# Altium schematic sheet DDR4_SODIMM_PWR.SchDoc
size A3
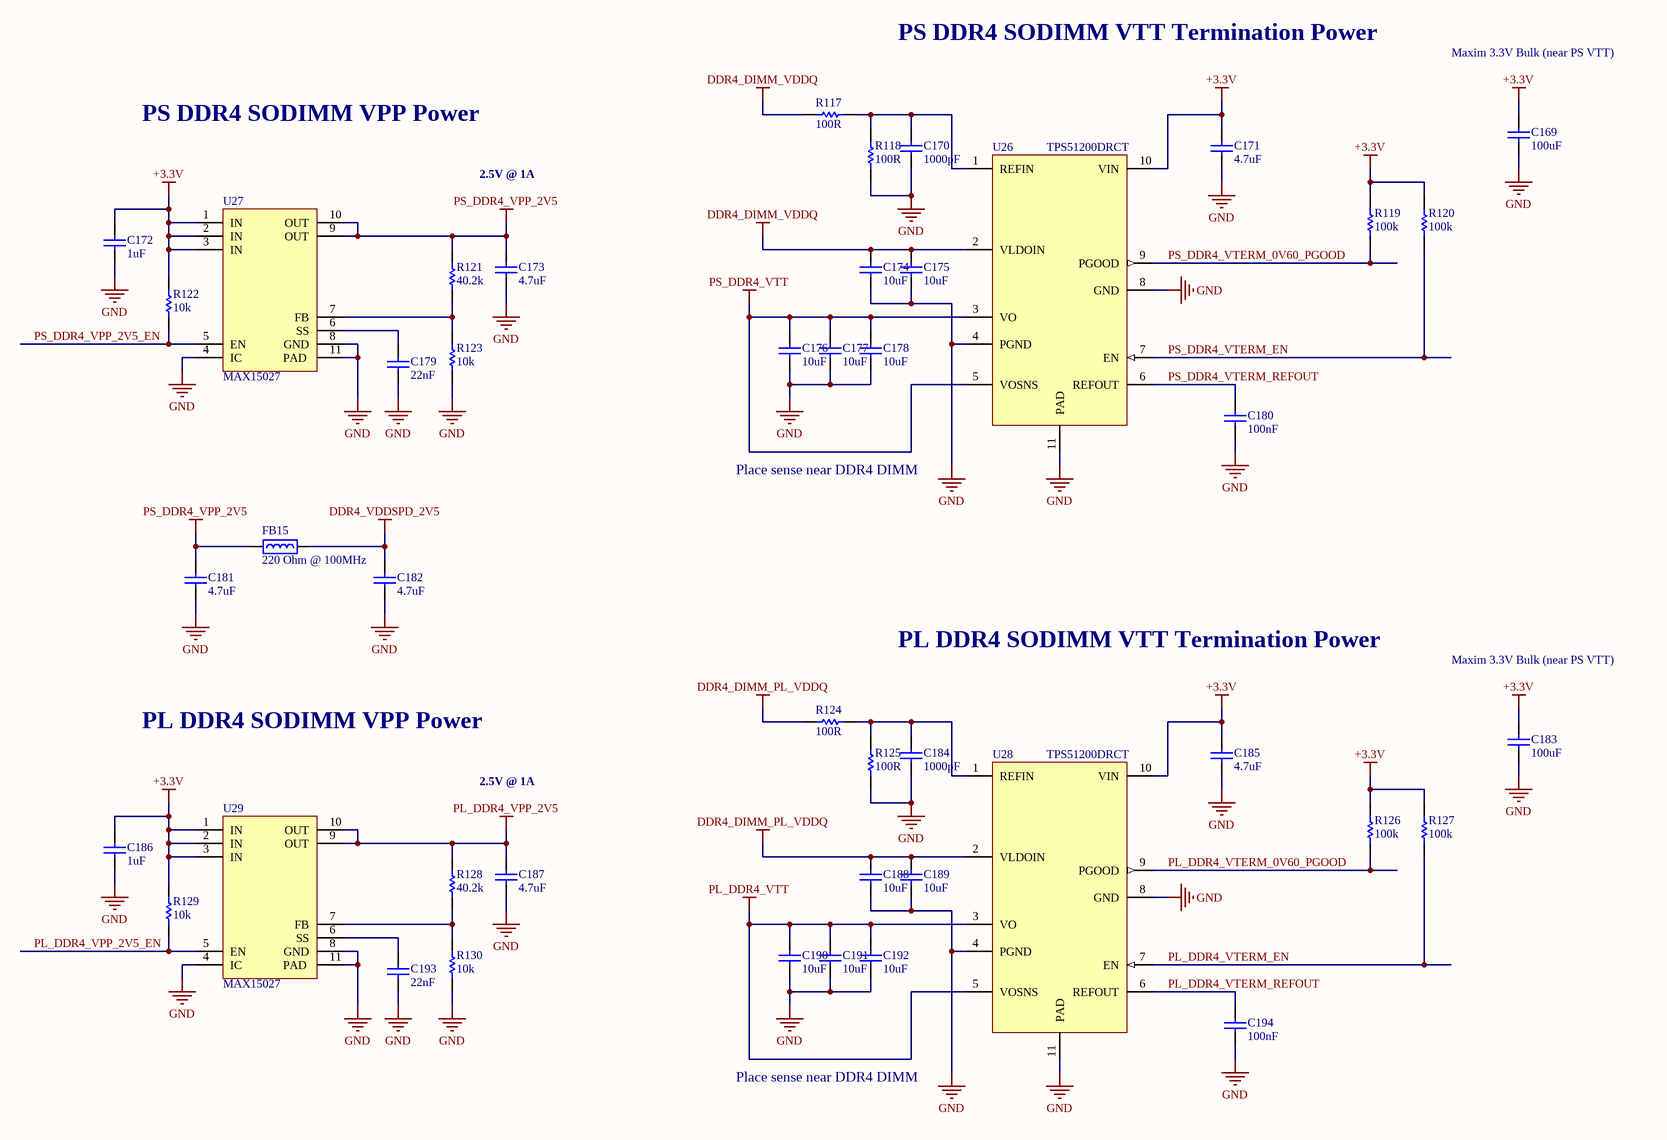
[diagram p0: DDR4_SODIMM_PWR.SchDoc]

## Parts
C169  100uF  [CAPC3225N_1210]
C170  1000pF  [CAPC1005L_0402]
C171  4.7uF  [CAPC1005L_0402]
C172  1uF  [CAPC1005L_0402]
C173  4.7uF  [CAPC1005L_0402]
C174  10uF  [CAPC1005L_0402]
C175  10uF  [CAPC1005L_0402]
C176  10uF  [CAPC1005L_0402]
C177  10uF  [CAPC1005L_0402]
C178  10uF  [CAPC1005L_0402]
C179  22nF  [CAPC1005L_0402]
C180  100nF  [CAPC1005L_0402]
C181  4.7uF  [CAPC1005L_0402]
C182  4.7uF  [CAPC1005L_0402]
C183  100uF  [CAPC3225N_1210]
C184  1000pF  [CAPC1005L_0402]
C185  4.7uF  [CAPC1005L_0402]
C186  1uF  [CAPC1005L_0402]
C187  4.7uF  [CAPC1005L_0402]
C188  10uF  [CAPC1005L_0402]
C189  10uF  [CAPC1005L_0402]
C190  10uF  [CAPC1005L_0402]
C191  10uF  [CAPC1005L_0402]
C192  10uF  [CAPC1005L_0402]
C193  22nF  [CAPC1005L_0402]
C194  100nF  [CAPC1005L_0402]
FB15  Impedance @ Frequency: 220 Ohm @ 100MHz  [INDC1608N_0603]  (hidden comment: BEAD0603_220_2A5_40M)
R117  value 100R  [RESC1005L_0402]  (hidden comment: RES0402_100R_0W1_1T)
R118  value 100R  [RESC1005L_0402]  (hidden comment: RES0402_100R_0W1_1T)
R119  value 100k  [RESC1005L_0402]  (hidden comment: RES0402_100K_0W2_1T)
R120  value 100k  [RESC1005L_0402]  (hidden comment: RES0402_100K_0W2_1T)
R121  value 40.2k  [RESC1005L_0402]  (hidden comment: RES0402_40K2_0W1_1T)
R122  value 10k  [RESC1005L_0402]  (hidden comment: RES0402_10K_0W1_05T)
R123  value 10k  [RESC1005L_0402]  (hidden comment: RES0402_10K_0W1_05T)
R124  value 100R  [RESC1005L_0402]  (hidden comment: RES0402_100R_0W1_1T)
R125  value 100R  [RESC1005L_0402]  (hidden comment: RES0402_100R_0W1_1T)
R126  value 100k  [RESC1005L_0402]  (hidden comment: RES0402_100K_0W2_1T)
R127  value 100k  [RESC1005L_0402]  (hidden comment: RES0402_100K_0W2_1T)
R128  value 40.2k  [RESC1005L_0402]  (hidden comment: RES0402_40K2_0W1_1T)
R129  value 10k  [RESC1005L_0402]  (hidden comment: RES0402_10K_0W1_05T)
R130  value 10k  [RESC1005L_0402]  (hidden comment: RES0402_10K_0W1_05T)
U26  TPS51200DRCT  [DRC_S-PVSON-N10]
U27  MAX15027  [MAX15027_T1033+1_V]
U28  TPS51200DRCT  [DRC_S-PVSON-N10]
U29  MAX15027  [MAX15027_T1033+1_V]

## Nets
+3.3V: C169.2 C171.2 C172.2 C183.2 C185.2 C186.2 R119.2 R120.2 R122.2 R126.2 R127.2 R129.2 U26.10(VIN) U27.1(IN) U27.2(IN) U27.3(IN) U28.10(VIN) U29.1(IN) U29.2(IN) U29.3(IN)
DDR4_DIMM_PL_VDDQ: C188.2 C189.2 R124.2 U28.2(VLDOIN)
DDR4_DIMM_VDDQ: C174.2 C175.2 R117.2 U26.2(VLDOIN)
DDR4_VDDSPD_2V5: C182.2 FB15.2
GND: C169.1 C170.1 C171.1 C172.1 C173.1 C174.1 C175.1 C176.1 C177.1 C178.1 C179.1 C180.1 C181.1 C182.1 C183.1 C184.1 C185.1 C186.1 C187.1 C188.1 C189.1 C190.1 C191.1 C192.1 C193.1 C194.1 R118.2 R123.1 R125.2 R130.1 U26.4(PGND) U26.8(GND) U26.11(PAD) U27.4(IC) U27.8(GND) U27.11(PAD) U28.4(PGND) U28.8(GND) U28.11(PAD) U29.4(IC) U29.8(GND) U29.11(PAD)
PL_DDR4_VPP_2V5: C187.2 R128.2 U29.9(OUT) U29.10(OUT)
PL_DDR4_VTT: C190.2 C191.2 C192.2 U28.3(VO) U28.5(VOSNS)
PS_DDR4_VPP_2V5: C173.2 C181.2 FB15.1 R121.2 U27.9(OUT) U27.10(OUT)
PS_DDR4_VTT: C176.2 C177.2 C178.2 U26.3(VO) U26.5(VOSNS)
PL_DDR4_VPP_2V5_EN: R129.1 U29.5(EN)
PL_DDR4_VTERM_0V60_PGOOD: R126.1 U28.9(PGOOD)
PL_DDR4_VTERM_EN: R127.1 U28.7(EN)
PL_DDR4_VTERM_REFOUT: C194.2 U28.6(REFOUT)
PS_DDR4_VPP_2V5_EN: R122.1 U27.5(EN)
PS_DDR4_VTERM_0V60_PGOOD: R119.1 U26.9(PGOOD)
PS_DDR4_VTERM_EN: R120.1 U26.7(EN)
PS_DDR4_VTERM_REFOUT: C180.2 U26.6(REFOUT)
NetC170_2: C170.2 R117.1 R118.1 U26.1(REFIN)
NetC179_2: C179.2 U27.6(SS)
NetC184_2: C184.2 R124.1 R125.1 U28.1(REFIN)
NetC193_2: C193.2 U29.6(SS)
NetR121_1: R121.1 R123.2 U27.7(FB)
NetR128_1: R128.1 R130.2 U29.7(FB)

## Notes on the sheet
- PS DDR4 SODIMM VTT Termination Power
- Maxim 3.3V Bulk (near PS VTT)
- PS DDR4 SODIMM VPP Power
- 2.5V @ 1A
- Place sense near DDR4 DIMM
- PL DDR4 SODIMM VTT Termination Power
- PL DDR4 SODIMM VPP Power

## Library data of the parts
C169 C183 = CAPCER1210X5R100U16V_20T: CAP CER 100UF 16V X5R 1210; Manufacturer 1: Taiyo Yuden; Manufacturer Part Number 1: EMK325ABJ107MM-T; Tolerance: 20%; Package: 1210; ComponentLink1Description: Datasheet; Value: 100uF; Voltage: 16V; Temperature Coefficient: X5R; Supplier 1: Digi-Key; Supplier Part Number 1: 587-3152-1-ND; Operating Temperature: -55°C ~ 85°C
C170 C184 = CAPCER0402X7R1000P50V_10T: CAP CER 1000PF 50V X7R 0402; Manufacturer 1: Murata Electronics North America; Manufacturer Part Number 1: GRM155R71H102KA01D; Tolerance: 10%; Package: 0402; ComponentLink1Description: Datasheet; Value: 1000pF; Voltage: 50V; Temperature Coefficient: X7R; Supplier 1: Digi-Key; Supplier Part Number 1: 490-1303-1-ND; Operating Temperature: -55°C ~ 125°C
C171 C173 C181 C182 C185 C187 = CAPCER0402X5R4U710V_10T: CAP CER 4.7UF 10V X5R 0402; Manufacturer 1: TDK Corporation; Manufacturer Part Number 1: C1005X5R1A475K050BC; Tolerance: 10%; Package: 0402; ComponentLink1Description: Datasheet; Value: 4.7uF; Voltage: 10V; Temperature Coefficient: x5R; Supplier 1: Digi-Key; Supplier Part Number 1: 445-13820-1-ND; Operating Temperature: -55°C ~ 85°C
C172 C186 = CAPCER0402X5R1U16V_20T: CAP CER 1UF 16V X5R 0402; Manufacturer 1: Murata Electronics North America; Manufacturer Part Number 1: GRM155R61C105ME01D; Tolerance: 20%; Package: 0402; ComponentLink1Description: Datasheet; Value: 1uF; Voltage: 16V; Temperature Coefficient: X5R; Supplier 1: Digi-Key; Supplier Part Number 1: 490-10454-1-ND; Operating Temperature: -55°C ~ 85°C
C174-C178 C188-C192 = CAPCER0402X5R10U10V_20T: CAP CER 10UF 10V X5R 0402; Manufacturer 1: Samsung Electro-Mechanics America, Inc.; Manufacturer Part Number 1: CL05A106MP5NUNC; Tolerance: 20%; Package: 0402; ComponentLink1Description: Datasheet; Value: 10uF; Voltage: 10V; Temperature Coefficient: X5R; Supplier 1: Digi-Key; Supplier Part Number 1: 1276-1450-1-ND; Operating Temperature: -55°C ~ 85°C
C179 C193 = CAPCER0402X7R22N50V_10T: CAP CER 0.022UF 50V X7R 0402; Manufacturer 1: Murata Electronics North America; Manufacturer Part Number 1: GRM155R71H223KA12D; Tolerance: 10%; Package: 0402; ComponentLink1Description: Datasheet; Value: 22nF; Voltage: 50V; Temperature Coefficient: X7R; Supplier 1: Digi-Key; Supplier Part Number 1: 490-3884-1-ND; Operating Temperature: -55°C ~ 125°C
C180 C194 = CAPCER0402X7R100N25V_10T: CAP CER 0.1UF 25V X7R 0402; Manufacturer 1: Murata Electronics North America; Manufacturer Part Number 1: GRM155R71E104KE14D; Tolerance: 10%; Package: 0402; ComponentLink1Description: Datasheet; Value: 100nF; Voltage: 25V; Temperature Coefficient: X7R; Supplier 1: Digi-Key; Supplier Part Number 1: 490-10698-1-ND; Operating Temperature: -55°C ~ 125°C
FB15 = BEAD0603_220_2A5_40M: FERRITE BEAD 220 OHM 0603 1LN; Manufacturer 1: Murata Electronics North America; Manufacturer Part Number 1: BLM18SG221TN1D; Current Rating (Max): 2.5A; DC Resistance (DCR) (Max): 40 mohm; Package: 0603; ComponentLink1Description: Datasheet; ComponentLink1URL: C:\Users\Public\Documents\Altium\AD16\Library\PDF\ENFA0003.pdf; Supplier 1: Digi-Key; Supplier Part Number 1: 490-5225-1-ND; Operating Temperature: -55°C ~ 125°C
R117 R118 R124 R125 = RES0402_100R_0W1_1T: RES SMD 100 OHM 1% 1/10W 0402; Manufacturer 1: Panasonic Electronic Components; Manufacturer Part Number 1: ERJ-2RKF1000X; Package: 0402; ComponentLink1Description: Datasheet; Power: 1/10W; Tolerance: 1%; Supplier 1: Digi-Key; Supplier Part Number 1: P100LCT-ND
R119 R120 R126 R127 = RES0402_100K_0W2_1T: RES SMD 100K OHM 1% 1/5W 0402; Manufacturer 1: Vishay Dale; Manufacturer Part Number 1: RCS0402100KFKED; Package: 0402; ComponentLink1Description: Datasheet; Power: 1/5W; Tolerance: 1%; Supplier 1: Digi-Key; Supplier Part Number 1: 541-2899-1-ND
R121 R128 = RES0402_40K2_0W1_1T: RES SMD 40.2K OHM 1% 1/10W 0402; Manufacturer 1: Panasonic Electronic Components; Manufacturer Part Number 1: ERJ-2RKF4022X; Package: 0402; ComponentLink1Description: Datasheet; Power: 1/10W; Tolerance: 1%; Supplier 1: Digi-Key; Supplier Part Number 1: P40.2KLCT-ND
R122 R123 R129 R130 = RES0402_10K_0W1_05T: RES SMD 10K OHM 0.5% 1/16W 0402; Manufacturer 1: Panasonic Electronic Components; Manufacturer Part Number 1: ERJ-2RHD1002X; Package: 0402; ComponentLink1Description: Datasheet; Power: 1/16W; Tolerance: 0.5%; Supplier 1: Digi-Key; Supplier Part Number 1: P15984CT-ND
U26 U28 = TPS51200DRCT: IC SINK/SOURCE DDR REG 10-SON; Manufacturer 1: Texas Instruments; ComponentLink1Description: Datasheet; ComponentLink1URL: C:\Users\Public\Documents\Altium\AD16\Library\PDF\tps51200.pdf; Supplier 1: Digi-Key; Supplier Part Number 1: 296-23830-1-ND; Manufacturer Part Number 1: TPS51200DRCT; Operating Temperature: -40°C ~ 85°C
U27 U29 = MAX15027: IC REG LINEAR POS ADJ 1A 10TDFN; Manufacturer 1: Maxim Integrated; Manufacturer Part Number 1: MAX15027ATB+T; ComponentLink1Description: Datasheet; ComponentLink1URL: C:\Users\Public\Documents\Altium\AD16\Library\PDF\MAX15027-MAX15028.pdf; Supplier 1: Digi-Key; Supplier Part Number 1: MAX15027ATB+TCT-ND; Operating Temperature: -40°C ~ 125°C